# Altium schematic sheet OSSI-1 COMMS_2.SchDoc: TITLE:
size 410 x 286 mm; Date: Date:; >LAST_DATE_TIME: 01/11/2015 13:25:20; Sheet:: Sheet:; >SHEET: 3; REV:: REV:; Document Number:: Document Number:; >DRAWING_NAME: OSSI-1 COMMS.sch
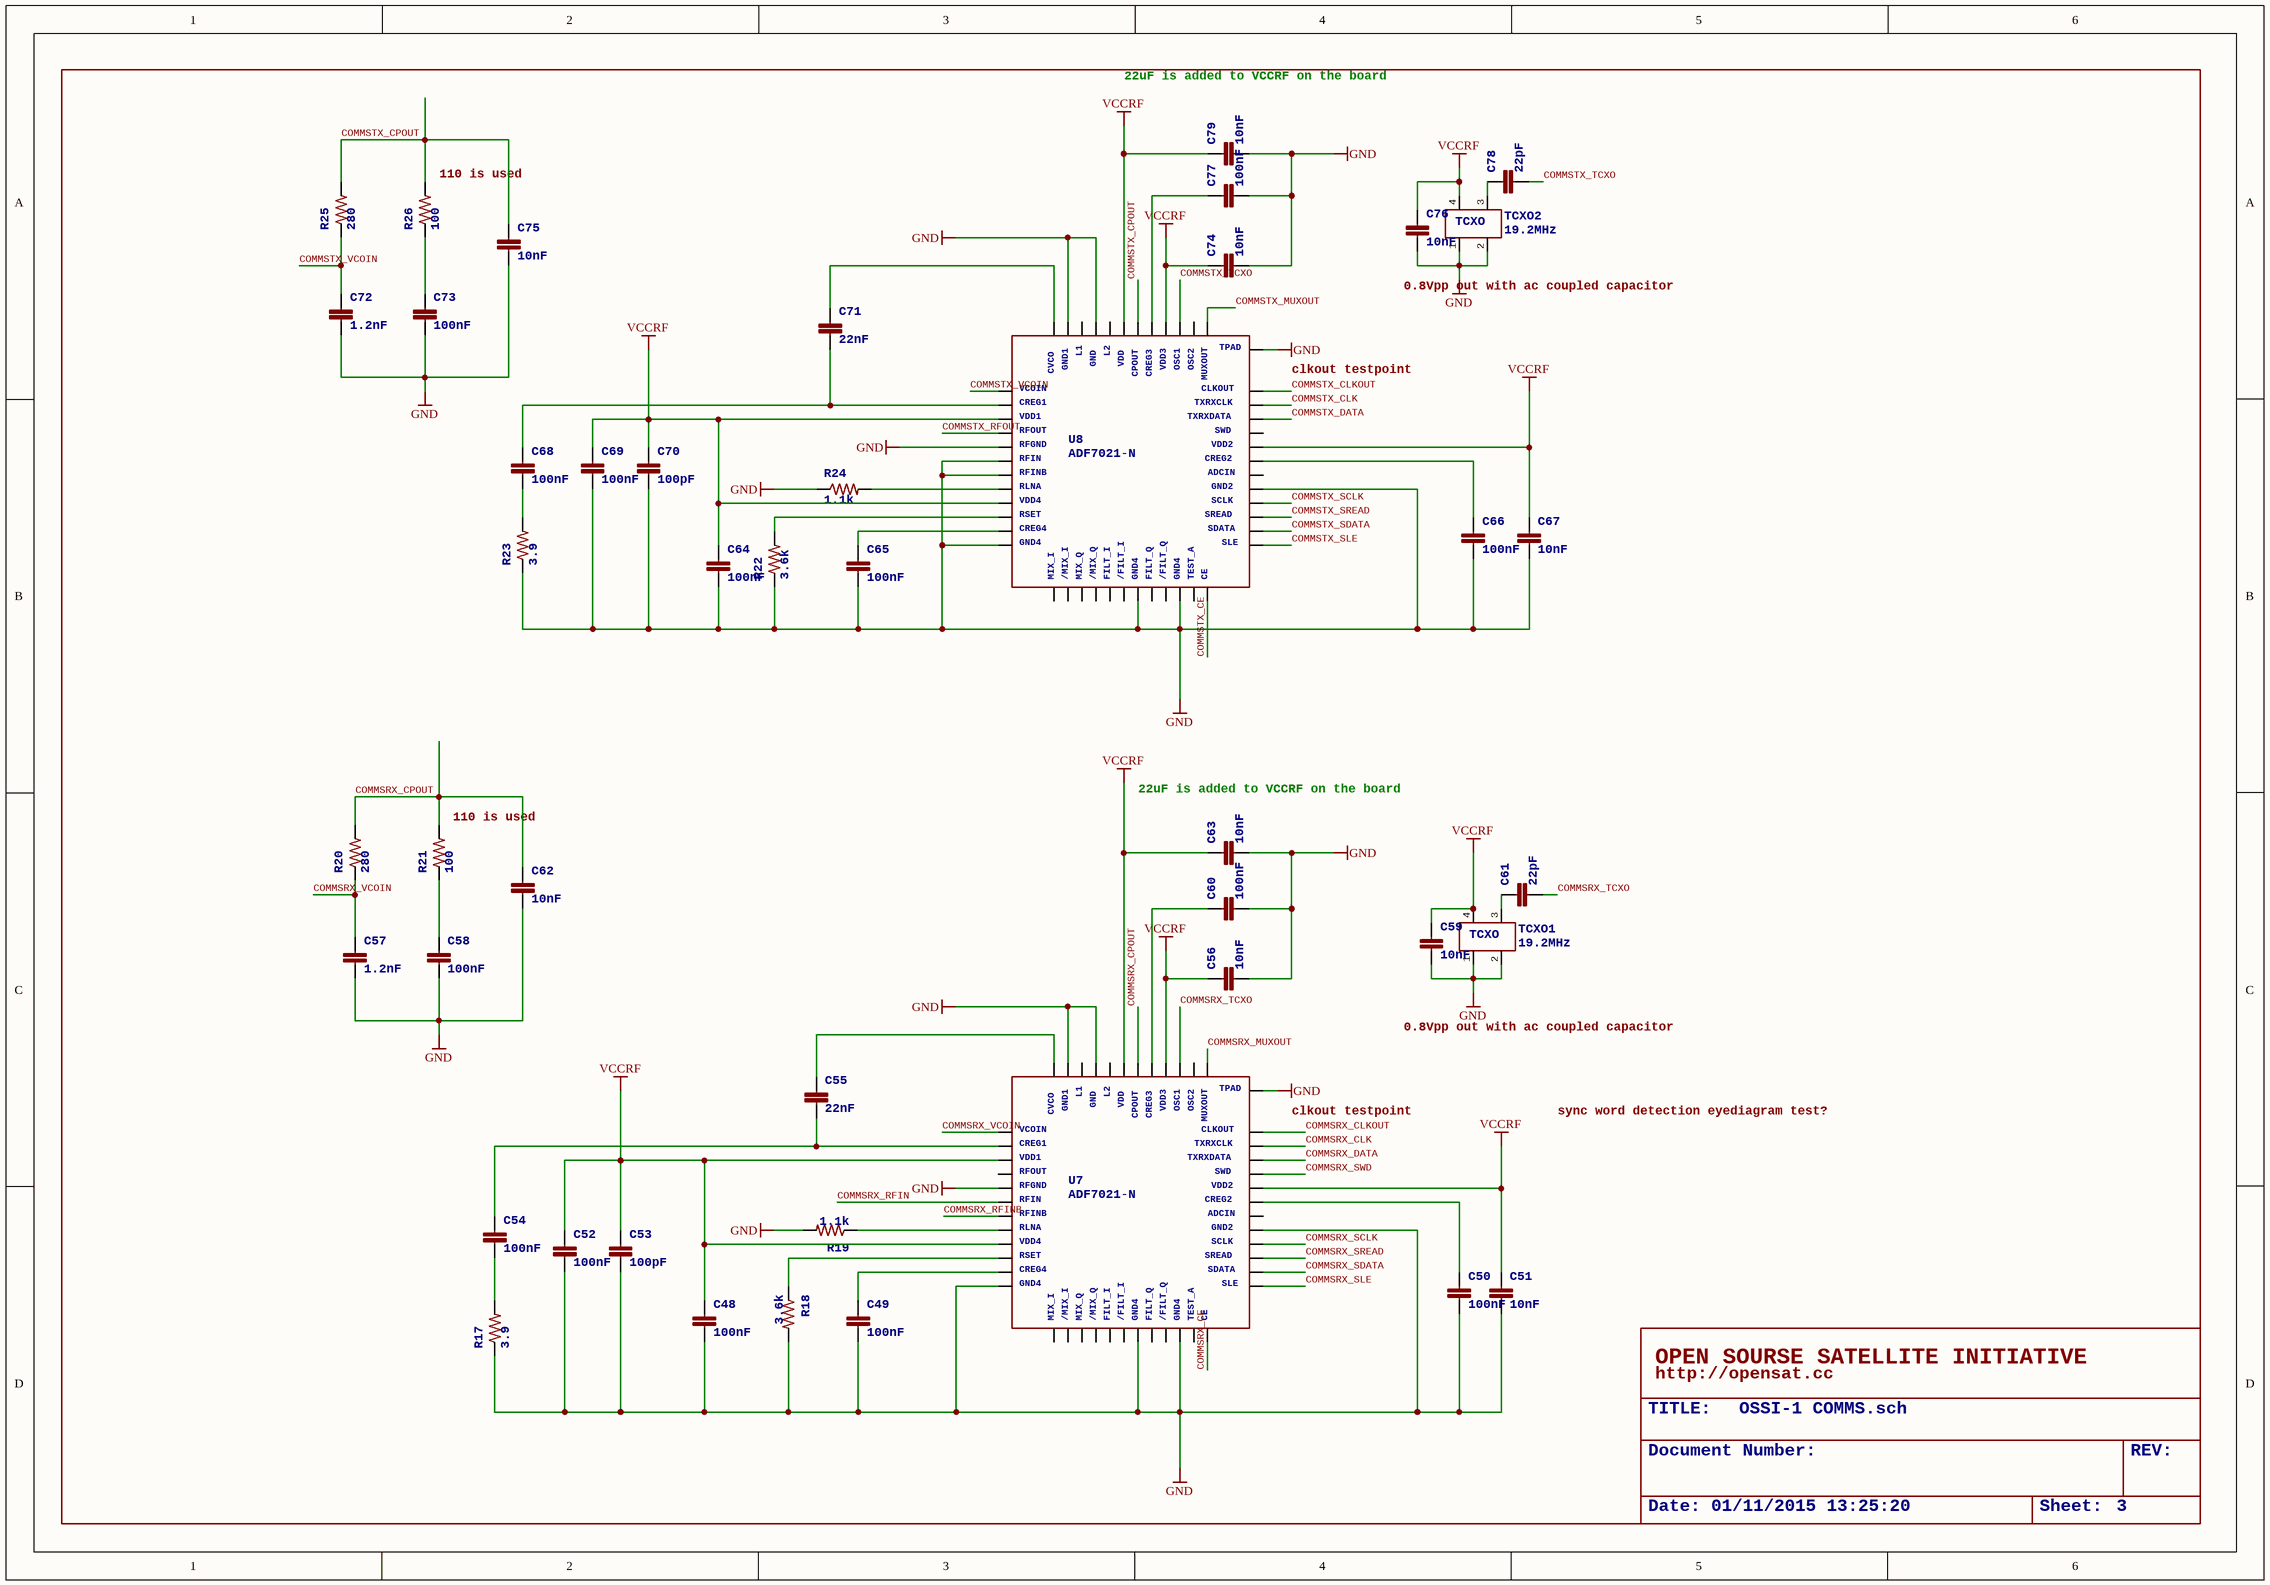
[diagram p0: OSSI-1 COMMS_2.SchDoc]

## Parts
C48  >NAME: C48  [C0603(1608)]  (hidden comment: 100nF)
C49  >NAME: C49  [C0603(1608)]  (hidden comment: 100nF)
C50  >NAME: C50  [C0603(1608)]  (hidden comment: 100nF)
C51  >NAME: C51  [C0603(1608)]  (hidden comment: 10nF)
C52  >NAME: C52  [C0603(1608)]  (hidden comment: 100nF)
C53  >NAME: C53  [C0603(1608)]  (hidden comment: 100pF)
C54  >NAME: C54  [C0603(1608)]  (hidden comment: 100nF)
C55  >NAME: C55  [C0603(1608)]  (hidden comment: 22nF)
C56  >NAME: C56  [C0603(1608)]  (hidden comment: 10nF)
C57  >NAME: C57  [C0603(1608)]  (hidden comment: 1.2nF)
C58  >NAME: C58  [C0603(1608)]  (hidden comment: 100nF)
C59  >NAME: C59  [C0603(1608)]  (hidden comment: 10nF)
C60  >NAME: C60  [C0603(1608)]  (hidden comment: 100nF)
C61  >NAME: C61  [C0603(1608)]  (hidden comment: 22pF)
C62  >NAME: C62  [C0603(1608)]  (hidden comment: 10nF)
C63  >NAME: C63  [C0603(1608)]  (hidden comment: 10nF)
C64  >NAME: C64  [C0603(1608)]  (hidden comment: 100nF)
C65  >NAME: C65  [C0603(1608)]  (hidden comment: 100nF)
C66  >NAME: C66  [C0603(1608)]  (hidden comment: 100nF)
C67  >NAME: C67  [C0603(1608)]  (hidden comment: 10nF)
C68  >NAME: C68  [C0603(1608)]  (hidden comment: 100nF)
C69  >NAME: C69  [C0603(1608)]  (hidden comment: 100nF)
C70  >NAME: C70  [C0603(1608)]  (hidden comment: 100pF)
C71  >NAME: C71  [C0603(1608)]  (hidden comment: 22nF)
C72  >NAME: C72  [C0603(1608)]  (hidden comment: 1.2nF)
C73  >NAME: C73  [C0603(1608)]  (hidden comment: 100nF)
C74  >NAME: C74  [C0603(1608)]  (hidden comment: 10nF)
C75  >NAME: C75  [C0603(1608)]  (hidden comment: 10nF)
C76  >NAME: C76  [C0603(1608)]  (hidden comment: 10nF)
C77  >NAME: C77  [C0603(1608)]  (hidden comment: 100nF)
C78  >NAME: C78  [C0603(1608)]  (hidden comment: 22pF)
C79  >NAME: C79  [C0603(1608)]  (hidden comment: 10nF)
R17  >NAME: R17  [R0603(1608)]  (hidden comment: 3.9)
R18  >NAME: R18  [R0603(1608)]  (hidden comment: 3.6k)
R19  >NAME: R19  [R0603(1608)]  (hidden comment: 1.1k)
R20  >NAME: R20  [R0603(1608)]  (hidden comment: 280)
R21  >NAME: R21  [R0603(1608)]  (hidden comment: 100)
R22  >NAME: R22  [R0603(1608)]  (hidden comment: 3.6k)
R23  >NAME: R23  [R0603(1608)]  (hidden comment: 3.9)
R24  >NAME: R24  [R0603(1608)]  (hidden comment: 1.1k)
R25  >NAME: R25  [R0603(1608)]  (hidden comment: 280)
R26  >NAME: R26  [R0603(1608)]  (hidden comment: 100)
TCXO1  >NAME: TCXO1  [TCXO_M532]  (hidden comment: 19.2MHz)
TCXO2  >NAME: TCXO2  [TCXO_M532]  (hidden comment: 19.2MHz)
U7  >NAME: U7  [LFCSP48]  (hidden comment: ADF7021-N)
U8  >NAME: U8  [LFCSP48]  (hidden comment: ADF7021-N)

## Nets
GND: C48.2 C49.2 C50.2 C51.2 C52.2 C53.2 C56.2 C57.2 C58.2 C59.2 C60.2 C62.2 C63.2 C64.2 C65.2 C66.2 C67.2 C69.2 C70.2 C72.2 C73.2 C74.2 C75.2 C76.2 C77.2 C79.2 R17.1 R18.2 R19.2 R22.1 R23.1 R24.1 TCXO1.1(P$1) TCXO1.2(P$2) TCXO2.1(P$1) TCXO2.2(P$2) U7.5(P$5) U7.12(P$12) U7.19(P$19) U7.22(P$22) U7.29(P$29) U7.45(P$45) U7.47(P$47) U7.EXP(P$49) U8.5(P$5) U8.6(P$6) U8.7(P$7) U8.12(P$12) U8.19(P$19) U8.22(P$22) U8.29(P$29) U8.45(P$45) U8.47(P$47) U8.EXP(P$49)
VCCRF: C48.1 C51.1 C52.1 C53.1 C56.1 C59.1 C63.1 C64.1 C67.1 C69.1 C70.1 C74.1 C76.1 C79.1 TCXO1.4(P$4) TCXO2.4(P$4) U7.3(P$3) U7.9(P$9) U7.32(P$32) U7.40(P$40) U7.43(P$43) U8.3(P$3) U8.9(P$9) U8.32(P$32) U8.40(P$40) U8.43(P$43)
COMMSRX_CE: U7.24(P$24)
COMMSRX_CLK: U7.35(P$35)
COMMSRX_CLKOUT: U7.36(P$36)
COMMSRX_CPOUT: C62.1 R20.2 R21.2 U7.42(P$42)
COMMSRX_DATA: U7.34(P$34)
COMMSRX_MUXOUT: U7.37(P$37)
COMMSRX_RFIN: U7.6(P$6)
COMMSRX_RFINB: U7.7(P$7)
COMMSRX_SCLK: U7.28(P$28)
COMMSRX_SDATA: U7.26(P$26)
COMMSRX_SLE: U7.25(P$25)
COMMSRX_SREAD: U7.27(P$27)
COMMSRX_SWD: U7.33(P$33)
COMMSRX_TCXO: C61.2 U7.39(P$39)
COMMSRX_VCOIN: C57.1 R20.1 U7.1(P$1)
COMMSTX_CE: U8.24(P$24)
COMMSTX_CLK: U8.35(P$35)
COMMSTX_CLKOUT: U8.36(P$36)
COMMSTX_CPOUT: C75.1 R25.2 R26.2 U8.42(P$42)
COMMSTX_DATA: U8.34(P$34)
COMMSTX_MUXOUT: U8.37(P$37)
COMMSTX_RFOUT: U8.4(P$4)
COMMSTX_SCLK: U8.28(P$28)
COMMSTX_SDATA: U8.26(P$26)
COMMSTX_SLE: U8.25(P$25)
COMMSTX_SREAD: U8.27(P$27)
COMMSTX_TCXO: C78.2 U8.39(P$39)
COMMSTX_VCOIN: C72.1 R25.1 U8.1(P$1)
NetC49_1: C49.1 U7.11(P$11)
NetC50_1: C50.1 U7.31(P$31)
NetC54_1: C54.1 C55.2 U7.2(P$2)
NetC54_2: C54.2 R17.2
NetC55_1: C55.1 U7.48(P$48)
NetC58_1: C58.1 R21.1
NetC60_1: C60.1 U7.41(P$41)
NetC61_1: C61.1 TCXO1.3(P$3)
NetC65_1: C65.1 U8.11(P$11)
NetC66_1: C66.1 U8.31(P$31)
NetC68_1: C68.1 C71.2 U8.2(P$2)
NetC68_2: C68.2 R23.2
NetC71_1: C71.1 U8.48(P$48)
NetC73_1: C73.1 R26.1
NetC77_1: C77.1 U8.41(P$41)
NetC78_1: C78.1 TCXO2.3(P$3)
NetR18_1: R18.1 U7.10(P$10)
NetR19_1: R19.1 U7.8(P$8)
NetR22_2: R22.2 U8.10(P$10)
NetR24_2: R24.2 U8.8(P$8)

Not connected (* = marked no-connect by the designer): U7 4(P$4) 13(P$13) 14(P$14) 15(P$15) 16(P$16) 17(P$17) 18(P$18) 20(P$20) 21(P$21) 23(P$23) 30(P$30) 38(P$38) 44(P$44) 46(P$46); U8 13(P$13) 14(P$14) 15(P$15) 16(P$16) 17(P$17) 18(P$18) 20(P$20) 21(P$21) 23(P$23) 30(P$30) 33(P$33) 38(P$38) 44(P$44) 46(P$46)

## Notes on the sheet
- 22uF is added to VCCRF on the board
- (near R26) 110 is used
- 0.8Vpp out with ac coupled capacitor
- (near U8) clkout testpoint
- (near R21) 110 is used
- (near U7) clkout testpoint
- sync word detection eyediagram test?
- OPEN SOURSE SATELLITE INITIATIVE
- http://opensat.cc

## Library data of the parts
C48-C79 = C0603(1608)
  C48-C50 C52 C54 C58 C60 C64-C66 C68 C69 C73 C77: >VALUE: 100nF
  C51 C56 C59 C62 C63 C67 C74-C76 C79: >VALUE: 10nF
  C53 C70: >VALUE: 100pF
  C55 C71: >VALUE: 22nF
  C57 C72: >VALUE: 1.2nF
  C61 C78: >VALUE: 22pF
R17-R26 = R0603(1608)
  R17 R23: >VALUE: 3.9
  R18 R22: >VALUE: 3.6k
  R19 R24: >VALUE: 1.1k
  R20 R25: >VALUE: 280
  R21 R26: >VALUE: 100
TCXO1 TCXO2 = TCXO-M532: <b>532L25DT19M2000: CTO electronic components Model 532 19.2MHz TCXO for RF transeiver</b> / <ul> / <li>Clipped Sine Wave Output</li> / <li>Operating Voltage, +3.3Vdc</li> / <li>Operating Temperature to -30°C to +85°C</li> / <li>Frequency Stability: ±2.5ppm</li> / </ul>; TCXO: TCXO; >VALUE: 19.2MHz
U7 U8 = ADF7021-N: <B>ADF7021-N</B> / <br /> / RF transceiver from analog device; VCOIN: VCOIN; CREG1: CREG1; VDD1: VDD1; RFOUT: RFOUT; RFGND: RFGND; RFIN: RFIN; RFINB: RFINB; RLNA: RLNA; VDD4: VDD4; RSET: RSET; CREG4: CREG4; GND4: GND4; MIX_I: MIX_I; /MIX_I: /MIX_I; MIX_Q: MIX_Q; /MIX_Q: /MIX_Q; FILT_I: FILT_I; /FILT_I: /FILT_I; TEST_A: TEST_A; FILT_Q: FILT_Q; /FILT_Q: /FILT_Q; CE: CE; SLE: SLE; SDATA: SDATA; SREAD: SREAD; SCLK: SCLK; GND2: GND2; ADCIN: ADCIN; CREG2: CREG2; VDD2: VDD2; SWD: SWD; TXRXDATA: TXRXDATA; TXRXCLK: TXRXCLK; CLKOUT: CLKOUT; MUXOUT: MUXOUT; OSC2: OSC2; OSC1: OSC1; VDD3: VDD3; CREG3: CREG3; CPOUT: CPOUT; VDD: VDD; L2: L2; GND: GND; L1: L1; GND1: GND1; CVCO: CVCO; >VALUE: ADF7021-N; TPAD: TPAD